# EAGLE design OSSILEDController2132 (EAGLE 6.1)
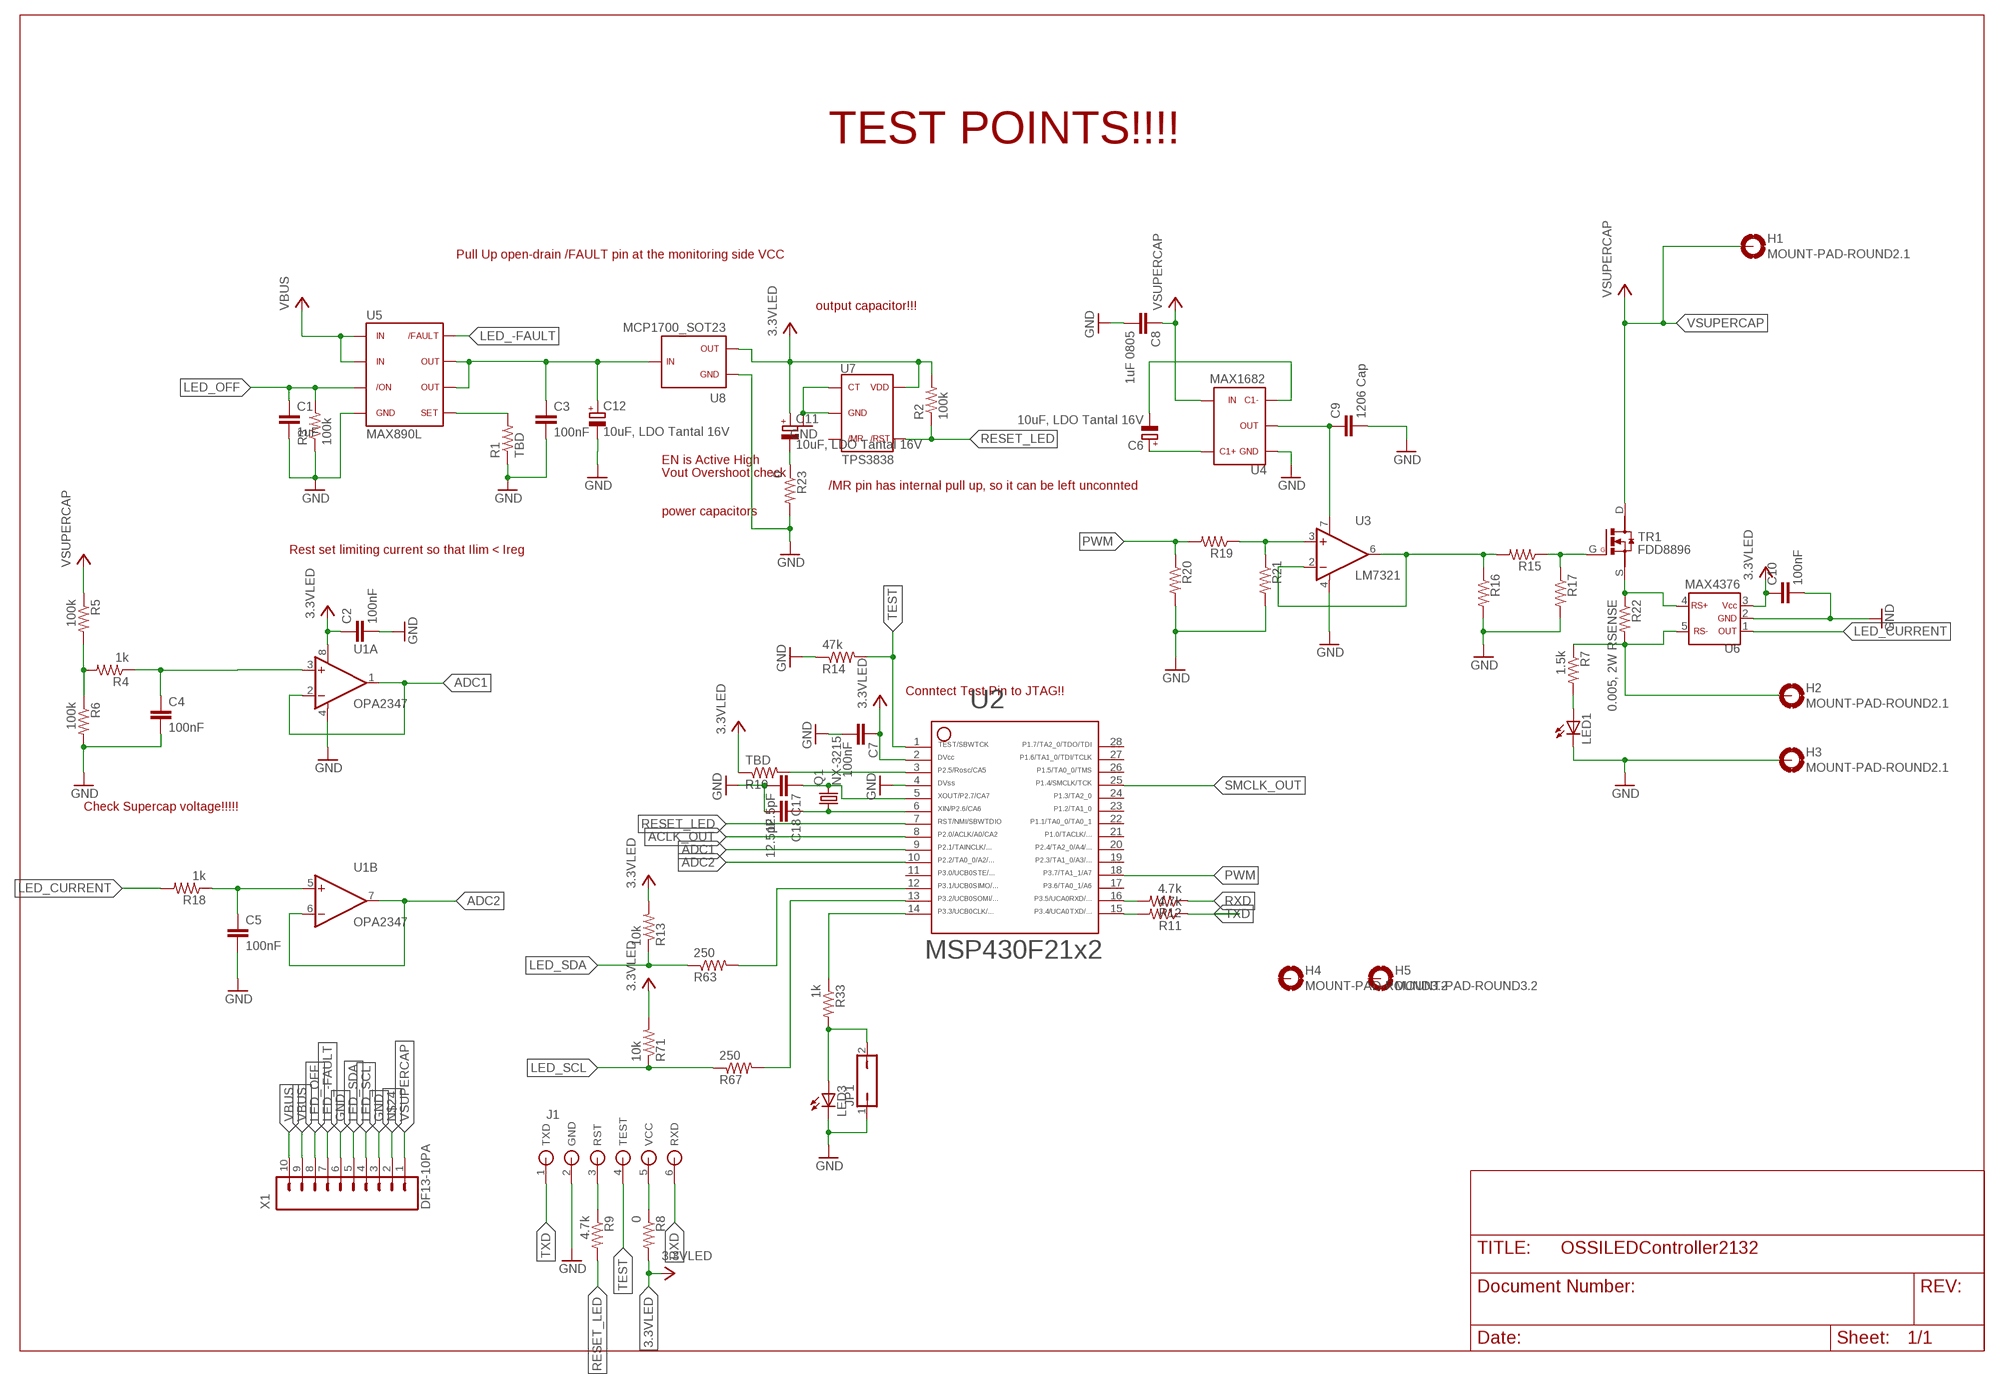
[diagram p0: schematic, sheet 1]

## Parts
C1  1uF  C0603(1608)  [C0603(1608)]
C2  100nF  C0603(1608)  [C0603(1608)]
C3  100nF  C0603(1608)  [C0603(1608)]
C4  100nF  C0603(1608)  [C0603(1608)]
C5  100nF  C0603(1608)  [C0603(1608)]
C6  10uF, LDO Tantal 16V  C-TANTAL-A  [C1206(3216)-A]
C7  100nF  C0603(1608)  [C0603(1608)]
C8  1uF 0805  C0805(2012)  [C0805(2012)]
C9  1206 Cap  C1206(3216)-GCM31  [C1206-GCM31]
C10  100nF  C0603(1608)  [C0603(1608)]
C11  10uF, LDO Tantal 16V  C-TANTAL-A  [C1206(3216)-A]
C12  10uF, LDO Tantal 16V  C-TANTAL-A  [C1206(3216)-A]
C17  12.5pF  C0603(1608)  [C0603(1608)]
C18  12.5pF  C0603(1608)  [C0603(1608)]
H1  MOUNT-PAD-ROUND2.1  [2.1-PAD-ROUND]
H2  MOUNT-PAD-ROUND2.1  [2.1-PAD-ROUND]
H3  MOUNT-PAD-ROUND2.1  [2.1-PAD-ROUND]
H4  MOUNT-PAD-ROUND3.2  [3.2-PAD-ROUND]
H5  MOUNT-PAD-ROUND3.2  [3.2-PAD-ROUND]
J1  JTAG-SBW-6  [SMD-PAD-6]
JP1  JP1Q  [JP1]
LED1  LEDCHIPLED_0603  [CHIPLED_0603]
LED3  LED0603  [LED-0603]
Q1  NX-3215  [NX-3215]
R1  TBD  R0603(1608)  [R0603(1608)]
R2  100k  R0603(1608)  [R0603(1608)]
R3  100k  R0603(1608)  [R0603(1608)]
R4  1k  R0603(1608)  [R0603(1608)]
R5  100k  R0603(1608)  [R0603(1608)]
R6  100k  R0603(1608)  [R0603(1608)]
R7  1.5k  R0603(1608)  [R0603(1608)]
R8  0  R0603(1608)  [R0603(1608)]
R9  4.7k  R0603(1608)  [R0603(1608)]
R10  TBD  R0603(1608)  [R0603(1608)]
R11  4.7k  R0603(1608)  [R0603(1608)]
R12  4.7k  R0603(1608)  [R0603(1608)]
R13  10k  R0603(1608)  [R0603(1608)]
R14  47k  R0603(1608)  [R0603(1608)]
R15  R0603(1608)  [R0603(1608)]
R16  R0603(1608)  [R0603(1608)]
R17  R0603(1608)  [R0603(1608)]
R18  1k  R0603(1608)  [R0603(1608)]
R19  R0603(1608)  [R0603(1608)]
R20  R0603(1608)  [R0603(1608)]
R21  R0603(1608)  [R0603(1608)]
R22  0.005, 2W RSENSE  RWSR2  [R4527(12070)]
R23  0  R0603(1608)  [R0603(1608)]
R33  1k  R0603(1608)  [R0603(1608)]
R63  250  R0603(1608)  [R0603(1608)]
R67  250  R0603(1608)  [R0603(1608)]
R71  10k  R0603(1608)  [R0603(1608)]
TR1  FDD8896  [TO252]
U1  OPA2347  [SOT23-8DCN]
U2  MSP430F2132  [PW28]
U3  LM7321  [SO8]
U4  MAX1682  [SOT23-5DBV]
U5  MAX890L  [SO8]
U6  MAX4376  [SOT23-5DBV]
U7  TPS3838  [SOT23-5DBV]
U8  MCP1700_SOT23  [SOT23]
X1  DF13-10PA  [DF13A-10P]

## Nets
3.3VLED: C2.1 C7.1 C10.1 C11.1(+) R2.2 R8.2 R10.1 R13.2 R71.2 U1.8(A:V+) U2.2 U6.3 U7.5 U8.2
ACLK_OUT: U2.8
ADC1: U1.1(A:OUT) U1.2(A:-IN) U2.9
ADC2: U1.6(B:-IN) U1.7(B:OUT) U2.10
GND: C1.2 C2.2 C3.2 C4.2 C5.2 C7.2 C8.2 C9.P$2 C10.2 C12.2(-) C17.2 C18.2 H3.B3,2(MOUNT) J1.2(GND) JP1.1 LED1.C LED3.C R1.1 R3.1 R6.2 R14.1 R16.2 R17.2 R20.2 R21.2 R23.2 U1.4(A:V-) U2.4 U3.4(V-) U4.1 U5.4 U6.2 U7.1 U7.2 U8.1 X1.3 X1.6
LED_-FAULT: U5.8 X1.7
LED_CURRENT: R18.2 U6.1
LED_OFF: C1.1 R3.2 U5.3 X1.8
LED_SCL: R67.1 R71.1 X1.4
LED_SDA: R13.1 R63.1 X1.5
N$1: R10.2 U2.3
N$2: J1.3(RST) R9.1
N$3: C4.1 R4.1 U1.3(A:+IN)
N$4: R15.1 R17.1 TR1.G
N$5: C3.1 C12.1(+) U5.6 U5.7 U8.3
N$6: R19.1 R21.1 U3.3(+IN)
N$7: C5.1 R18.1 U1.5(B:+IN)
N$8: H2.B3,2(MOUNT) R7.1 R22.P$2 U6.5
N$10: R1.2 U5.5
N$11: R4.2 R5.2 R6.1
N$12: C11.2(-) R23.1
N$13: C9.P$1 U3.7(V+) U4.2
N$14: R15.2 R16.1 U3.2(-IN) U3.6(OUT)
N$15: J1.5(VCC) R8.1
N$16: R22.P$1 TR1.S U6.4
N$19: C17.1 Q1.2 U2.5
N$20: C18.1 Q1.1 U2.6
N$21: JP1.2 LED3.A R33.2
N$22: R63.2 U2.12
N$23: R67.2 U2.13
N$24: X1.2
N$25: R33.1 U2.14
N$26: C6.2(-) U4.3
N$27: C6.1(+) U4.5
N$28: R12.2 U2.16
N$29: LED1.A R7.2
N$39: R11.2 U2.15
PWM: R19.2 R20.1 U2.18
RESET_LED: R2.1 R9.2 U2.7 U7.4
RXD: J1.6(RXD) R12.1
SMCLK_OUT: U2.25
TEST: J1.4(TEST) R14.2 U2.1
TXD: J1.1(TXD) R11.1
VBUS: U5.1 U5.2 X1.9 X1.10
VSUPERCAP: C8.1 H1.B3,2(MOUNT) R5.1 TR1.D U4.4 X1.1
Unconnected: H4.B3,2(MOUNT) H5.B3,2(MOUNT) U2.11 U2.17 U2.19 U2.20 U2.21 U2.22 U2.23 U2.24 U2.26 U2.27 U2.28 U7.3

## Notes on the sheet
- TEST POINTS!!!!
- Pull Up open-drain /FAULT pin at the monitoring side VCC
- output capacitor!!!
- EN is Active High
- Vout Overshoot check
- /MR pin has internal pull up, so it can be left unconnted
- power capacitors
- Rest set limiting current so that Ilim < Ireg
- Conntect Test Pin to JTAG!!
- Check Supercap voltage!!!!!

## Library data of the parts
C1-C5 C7-C10 C17 C18 = OSSI:C
C6 C11 C12 = OSSI:C-TANTAL-A: TAJA105M020RNJ Tantal Capacitor Manufacturer: AVX 1206(3126) Ref: www.avx.com/docs/techinfo/tantappl.pdf
H1-H5 = OSSI:MOUNT-PAD-ROUND
J1 = CC430:JTAG-SBW-6
JP1 = OSSI:JP1Q: JUMPER
LED1 = led:LED: LED OSRAM: - CHIPLED LG R971, LG N971, LY N971, LG Q971, LY Q971, LO R971, LY R971 LH N974, LH R974 LS Q976, LO Q976, LY Q976 LO Q996 - Hyper CHIPLED LW Q18S LB Q993, LB Q99A, LB R99A - SideLED LS A670, LO A670, LY A670, LG A670, LP A670 LB A673, LV A673, LT A673, LW A673 LH A674 LY A675 LS A676, LA A676, LO A676, LY A676, LW A676 LS A679, LY A679, LG A679 - Hyper Micro SIDELED® LS Y876, LA Y876, LO Y876, LY Y876 LT Y87S - SmartLED LW L88C, LW L88S LB L89C, LB L89S, LG L890 LS L89K, LO L89K, LY L89K LS L896, LA L896, LO L896, LY L896 - TOPLED LS T670, LO T670, LY T670, LG T670, LP T670 LSG T670, LSP T670, LSY T670, LOP T670, LYG T670 LG T671, LOG T671, LSG T671 LB T673, LV T673, LT T673, LW T673 LH T674 LS T676, LA T676, LO T676, LY T676, LB T676, LH T676, LSB T676, LW T676 LB T67C, LV T67C, LT T67C, LS T67K, LO T67K, LY T67K, LW E67C LS E67B, LA E67B, LO E67B, LY E67B, LB E67C, LV E67C, LT E67C LW T67C LS T679, LY T679, LG T679 LS T770, LO T770, LY T770, LG T770, LP T770 LB T773, LV T773, LT T773, LW T773 LH T774 LS E675, LA E675, LY E675, LS T675 LS T776, LA T776, LO T776, LY T776, LB T776 LHGB T686 LT T68C, LB T68C - Hyper Mini TOPLED® LB M676 - Mini TOPLED Santana® LG M470 LS M47K, LO M47K, LY M47K Source: http://www.osram.convergy.de LUXEON: - LUMILED® LXK2-PW12-R00, LXK2-PW12-S00, LXK2-PW14-U00, LXK2-PW14-V00 LXK2-PM12-R00, LXK2-PM12-S00, LXK2-PM14-U00 LXK2-PE12-Q00, LXK2-PE12-R00, LXK2-PE12-S00, LXK2-PE14-T00, LXK2-PE14-U00 LXK2-PB12-K00, LXK2-PB12-L00, LXK2-PB12-M00, LXK2-PB14-N00, LXK2-PB14-P00, LXK2-PB14-Q00 LXK2-PR12-L00, LXK2-PR12-M00, LXK2-PR14-Q00, LXK2-PR14-R00 LXK2-PD12-Q00, LXK2-PD12-R00, LXK2-PD12-S00 LXK2-PH12-R00, LXK2-PH12-S00 LXK2-PL12-P00, LXK2-PL12-Q00, LXK2-PL12-R00 Source: www.luxeon.com KINGBRIGHT: KA-3528ASYC Source: www.kingbright.com
LED3 = SparkFun:LED: LEDs Standard schematic elements and footprints for 5mm, 3mm, 1206, and 0603 sized LEDs. 5mm - Spark Fun Electronics SKU : COM-00529 (and others)
Q1 = OSSI:NX-3215: NDK 32.768 kHz SMD Crystal P/N: NX3215SA-32.768K-STD-MUA-9 Nominal frequency (kHz): 32.768 Package Size (L×W×H : mm): 3.2×1.5×0.8 Operating Temperature Range(*1) / Storage Temperature Range (°C): -40 to +85 / -40 to +85 Level of drive: 0.1µW (Max. 0.5µW) Frequency Tolerance (25±3°C): ±20×10-6 Load Capacitance: 9.0pF, 12.5pF Equivalent Series Resistance: 70kΩ Max. Ordering Code: NX3215SA-32.768K-STD-MUA-9 (Load Capacitance9.0pF) /NX3215SA-32.768K-STD-MUA-8 (Load Capacitance12.5pF)
R1-R23 R33 R63 R67 R71 = OSSI:R
TR1 = OSSI:FDD8896: FDD8896 N-Channel PowerTrench ® MOSFET
U1 = OSSI:OPA2347: OPA2347 RAIL-TO-RAIL INPUT AND OUTPUT SINGLE SUPPLY: 2.3V to 5.5V LOW IQ: 20µ
U2 = OSSI:MSP430F2132: *** MSP430F21x2 *** PW28
U3 = OSSI:LM7321: LM7321 Rail-to-Rail Input/Output ±15V, High Output Current and Unlimited Capacitive Load Operational Amplifier Texas Intrument
U4 = OSSI:MAX1682: MAX1682EUK+T Charge Pump
U5 = OSSI:MAX890L: MAX 890L 1.2A, Current-Limited, High-Side P-Channel Switch with Thermal Shutdown BY MAXIM
U6 = OSSI:MAX4376
U7 = OSSI:TPS3838: TPS3838 NanoPower Supervisory IC from texas instruments. TPS3838 is open-drain output
U8 = OSSI:MCP1700: MCP1700 LDO from Microchips
X1 = OSSI:DF13-10P

## Board
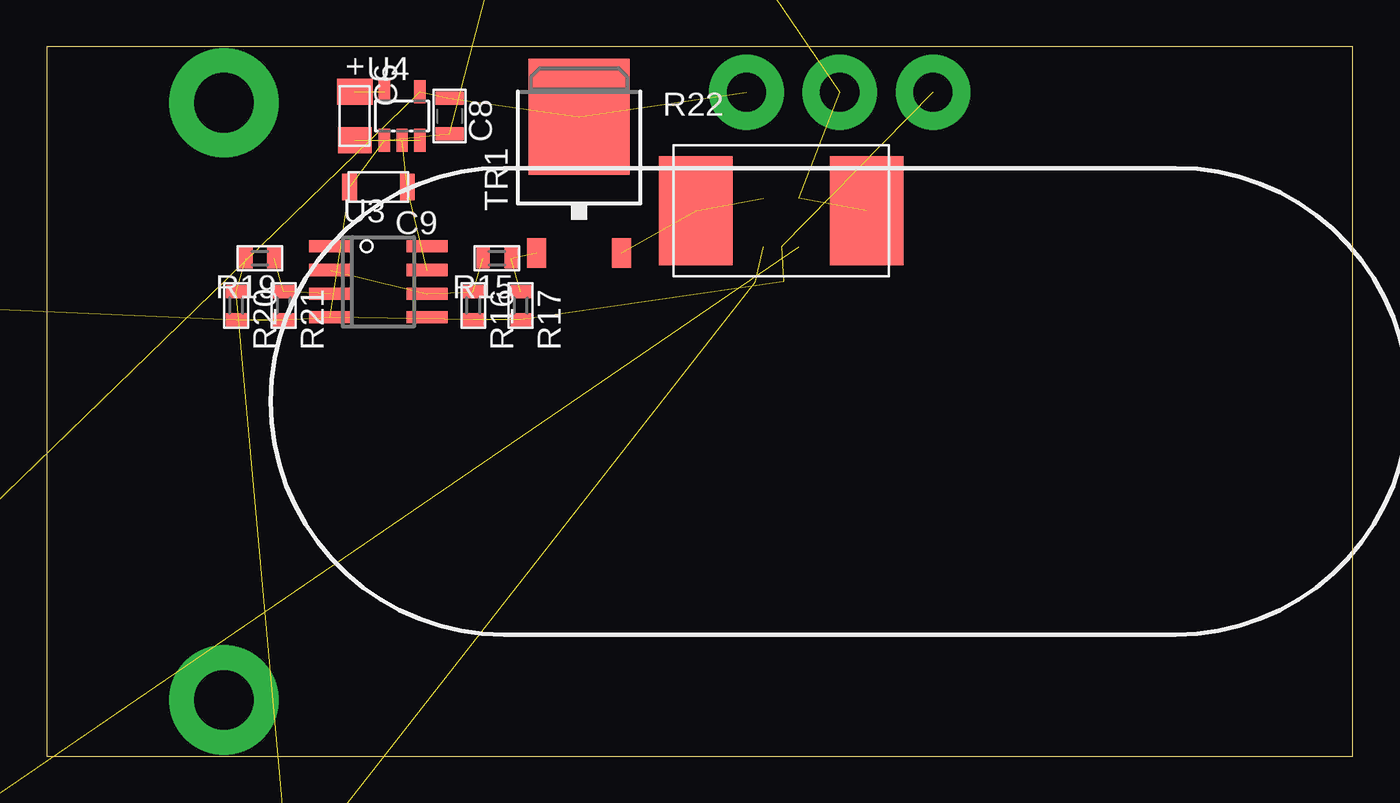
[diagram p1: board, top side]
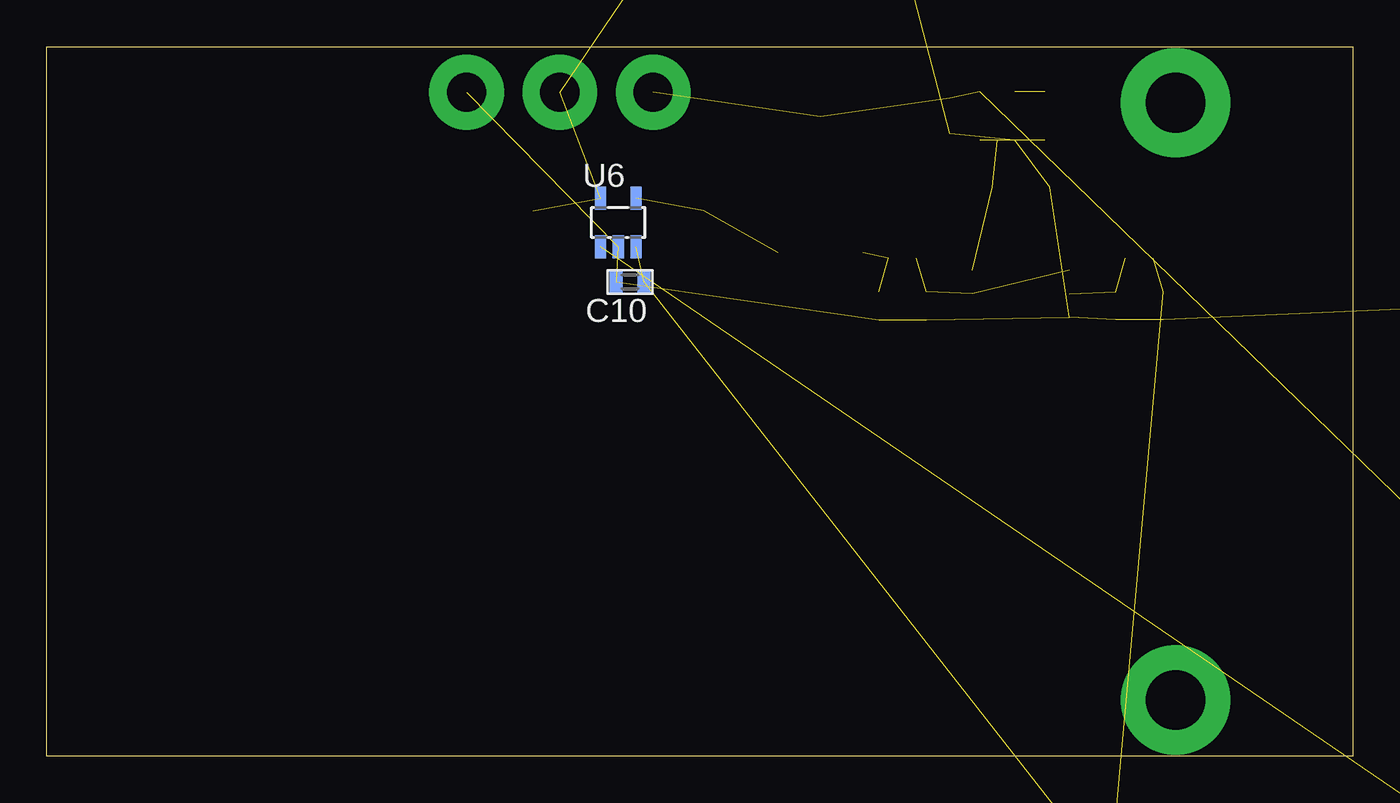
[diagram p2: board, bottom side, seen from below]

Size 70 x 38 mm. Coordinates in mm from the lower left corner, seen from the top.
Outline: 0,0 70,0 70,38 0,38 0,0
Copper layers (1*16): Top 0.035mm / dielectric 1.5mm / Bottom 0.035mm
Design rules: minimum track width 10mil, minimum drill 24mil, track to track 8mil, track to pad 8mil, pad to pad 8mil, via to via 8mil, smd to smd 8mil, copper to edge 40mil, drill to drill 8mil, minimum pad ring 10mil, minimum via ring 8mil, stop-mask expansion 4mil, vias tented up to drill 0mil, thermal gap 10mil

### Footprints (pad centres in the part's own frame; a part is rotated, then mirrored left to right if it is on the bottom)
C0603(1608) = smd 0.7 x 1.1: 1 -0.75,0; 2 0.75,0
C1206(3216)-A = smd 1.4 x 1.9: 1 -1.3,0 | smd 1.4 x 1.8: 2 1.3,0
C0805(2012) = smd 0.7 x 1.5: 1 -0.95,0; 2 0.95,0
C1206-GCM31 = smd 0.8 x 1.4: P$1 -1.55,0; P$2 1.55,0
2.1-PAD-ROUND = drill 2.1 pad 4: B3,2 0,0
3.2-PAD-ROUND = drill 3.2 pad 5.842: B3,2 0,0
SMD-PAD-6 = smd 0.625 x 3.5: 1 -3.125,0; 2 -1.875,0; 3 -0.625,0; 4 0.625,0; 5 1.875,0; 6 3.125,0
JP1 = drill 0.914 pad 1.676: 1 0,-1.27; 2 0,1.27
CHIPLED_0603 = smd 0.8 x 0.8: A 0,-0.75; C 0,0.75
LED-0603 = smd 0.8 x 0.8: A 0,-0.75; C 0,0.75
NX-3215 = smd 1 x 1.8: 1 -1.25,0; 2 1.25,0
R0603(1608) = smd 0.7 x 1.1: 1 -0.75,0; 2 0.75,0
R4527(12070) = smd 3.94 x 5.84: P$1 -4.575,0; P$2 4.575,0
TO252 = smd 5.4 x 6.2: D 0,2.5 | smd 1 x 1.6: G -2.28,-4.8; S 2.28,-4.8
SOT23-8DCN = smd 0.45 x 0.8: 1 -0.975,-1.35; 2 -0.325,-1.35; 3 0.325,-1.35; 4 0.975,-1.35; 5 0.975,1.35; 6 0.325,1.35; 7 -0.325,1.35; 8 -0.975,1.35
PW28 = smd 0.3 x 1.2: 1 -4.229,-2.908; 2 -3.579,-2.908; 3 -2.929,-2.908; 4 -2.279,-2.908; 5 -1.629,-2.908; 6 -0.979,-2.908; 7 -0.329,-2.908; 8 0.321,-2.908; 9 0.971,-2.908; 10 1.621,-2.908; 11 2.271,-2.908; 12 2.921,-2.908; 13 3.571,-2.908; 14 4.221,-2.908; 15 4.221,2.892; 16 3.571,2.892; 17 2.921,2.892; 18 2.271,2.892; 19 1.621,2.892; 20 0.971,2.892; 21 0.321,2.892; 22 -0.329,2.892; 23 -0.979,2.892; 24 -1.629,2.892; 25 -2.279,2.892; 26 -2.929,2.892; 27 -3.579,2.892; 28 -4.229,2.892
SO8 = smd 0.65 x 2.2: 1 -1.905,-2.6; 2 -0.635,-2.6; 3 0.635,-2.6; 4 1.905,-2.6; 5 1.905,2.6; 6 0.635,2.6; 7 -0.635,2.6; 8 -1.905,2.6
SOT23-5DBV = smd 0.6 x 1.22: 1 -0.95,-1.3; 2 0,-1.3; 3 0.95,-1.3; 4 0.95,1.3; 5 -0.95,1.3
SOT23 = smd 1 x 1.4: 1 -0.95,-1.1; 2 0.95,-1.1; 3 0,1.1
DF13A-10P = smd 0.7 x 2: 1 -5.625,0; 2 -4.375,0; 3 -3.125,0; 4 -1.875,0; 5 -0.625,0; 6 0.625,0; 7 1.875,0; 8 3.125,0; 9 4.375,0; 10 5.625,0 | smd 1.6 x 2.2: P$1 -7.875,3.3; P$2 7.875,3.3

### Placement (x,y rotation side)
C1  -11.43,1.91 0 top  (outside the outline)
C2  -25.4,-16.51 180 top  (outside the outline)
C3  -11.43,13.97 0 top  (outside the outline)
C4  -27.94,-19.05 270 top  (outside the outline)
C5  -27.94,-22.86 270 top  (outside the outline)
C6  16.51,34.29 270 top
C7  8.89,-12.7 0 top  (outside the outline)
C8  21.59,34.29 270 top
C9  17.78,30.48 180 top
C10  38.73,25.4 180 bottom
C11  -11.43,24.13 0 top  (outside the outline)
C12  -11.43,16.51 0 top  (outside the outline)
C17  3.81,-16.51 180 top  (outside the outline)
C18  3.81,-19.05 180 top  (outside the outline)
H1  37.5,35.56 0 top
H2  42.5,35.56 0 top
H3  47.5,35.56 0 top
H4  9.5,35 0 top
H5  9.5,3 0 top
J1  34.29,-48.26 0 top  (outside the outline)
JP1  -3.81,-45.72 0 top  (outside the outline)
LED1  27.94,58.42 180 top  (outside the outline)
LED3  -8.89,-46.99 180 top  (outside the outline)
Q1  6.35,-17.78 90 top  (outside the outline)
R1  -8.89,8.89 90 top  (outside the outline)
R2  -36.83,10.79 180 top  (outside the outline)
R3  -11.43,3.81 180 top  (outside the outline)
R4  -29.21,-16.51 180 top  (outside the outline)
R5  -33.02,-16.51 270 top  (outside the outline)
R6  -33.02,-19.05 270 top  (outside the outline)
R7  27.94,55.88 180 top  (outside the outline)
R8  35.56,-43.18 90 top  (outside the outline)
R9  33.02,-43.18 90 top  (outside the outline)
R10  3.81,-13.97 0 top  (outside the outline)
R11  31.11,-43.18 90 top  (outside the outline)
R12  37.47,-43.18 90 top  (outside the outline)
R13  2.54,-24.13 90 top  (outside the outline)
R14  34.29,-45.72 0 top  (outside the outline)
R15  24.13,26.67 180 top
R16  22.86,24.13 270 top
R17  25.4,24.13 270 top
R18  -30.48,-21.59 180 top  (outside the outline)
R19  11.43,26.67 180 top
R20  10.16,24.13 270 top
R21  12.7,24.13 270 top
R22  39.37,29.21 0 top
R23  -7.62,24.13 0 top  (outside the outline)
R33  -8.89,-44.45 270 top  (outside the outline)
R63  3.81,-24.13 90 top  (outside the outline)
R67  5.08,-24.13 90 top  (outside the outline)
R71  6.35,-24.13 90 top  (outside the outline)
TR1  28.53,31.75 0 top
U1  -25.4,-20.32 180 top  (outside the outline)
U2  11.43,-19.05 270 top  (outside the outline)
U3  17.78,25.4 270 top
U4  19.05,34.29 0 top
U5  -12.7,8.89 0 top  (outside the outline)
U6  39.37,28.57 0 bottom
U7  -36.83,6.35 0 top  (outside the outline)
U8  -11.43,20.32 180 top  (outside the outline)
X1  16.51,-44.45 180 top  (outside the outline)

### Tracks (layer width: path | path; a pad name or v marks a point on that pad's centre or on a via)
3.3VLED  (13 unrouted)
ADC1  (2 unrouted)
ADC2  (2 unrouted)
GND  (36 unrouted)
LED_-FAULT  (1 unrouted)
LED_CURRENT  (1 unrouted)
LED_OFF  (3 unrouted)
LED_SCL  (2 unrouted)
LED_SDA  (2 unrouted)
N$1  (1 unrouted)
N$2  (1 unrouted)
N$3  (2 unrouted)
N$4  (2 unrouted)
N$5  (4 unrouted)
N$6  (2 unrouted)
N$7  (2 unrouted)
N$8  (3 unrouted)
N$9
  cutout Bottom: 5.08,38.1 5.08,30.48 13.97,30.48 13.97,38.1
N$10  (1 unrouted)
N$11  (2 unrouted)
N$12  (1 unrouted)
N$13  (2 unrouted)
N$14  (3 unrouted)
N$15  (1 unrouted)
N$16  (2 unrouted)
N$17
  cutout Bottom: 5.08,0 5.08,7.62 13.97,7.62 13.97,0
N$19  (2 unrouted)
N$20  (2 unrouted)
N$21  (2 unrouted)
N$22  (1 unrouted)
N$23  (1 unrouted)
N$25  (1 unrouted)
N$26  (1 unrouted)
N$27  (1 unrouted)
N$28  (1 unrouted)
N$29  (1 unrouted)
N$39  (1 unrouted)
PWM  (2 unrouted)
RESET_LED  (3 unrouted)
RXD  (1 unrouted)
TEST  (2 unrouted)
TXD  (1 unrouted)
VBUS  (3 unrouted)
VSUPERCAP  (5 unrouted)